# Altium schematic sheet Connectors.SchDoc
size A4; SheetNumber: 4; SheetTotal: 5
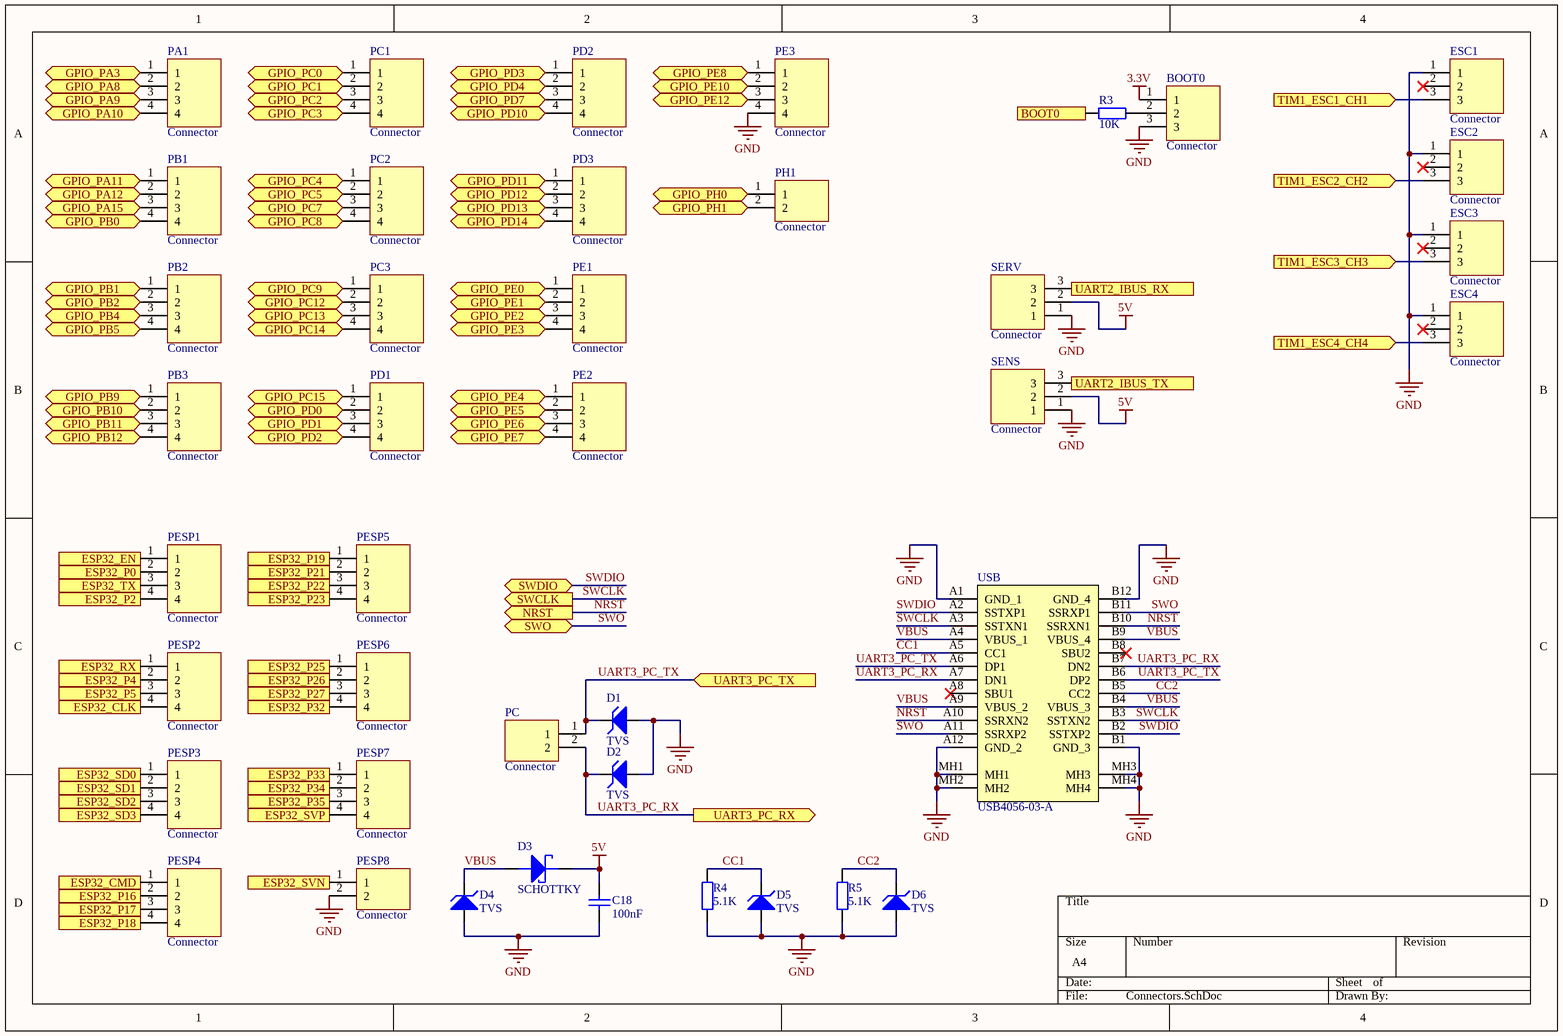
[diagram p0: Connectors.SchDoc]

## Parts
BOOT0  Connector  [FP_CONN3_TUSKE_254MM]
C18  100nF  [FP_0805_CAP_085]
D1  TVS  [FP_SMB]
D2  TVS  [FP_SMB]
D3  SCHOTTKY  [FP_SMA]
D4  TVS  [FP_SMB]
D5  TVS  [FP_SMB]
D6  TVS  [FP_SMB]
ESC1  Connector  [FP_CONN3_TUSKE_254MM]
ESC2  Connector  [FP_CONN3_TUSKE_254MM]
ESC3  Connector  [FP_CONN3_TUSKE_254MM]
ESC4  Connector  [FP_CONN3_TUSKE_254MM]
PA1  Connector  [FP_CONN4_TUSKE_254MM]
PB1  Connector  [FP_CONN4_TUSKE_254MM]
PB2  Connector  [FP_CONN4_TUSKE_254MM]
PB3  Connector  [FP_CONN4_TUSKE_254MM]
PC  Connector  [FP_CONN2_TUSKE_254MM]
PC1  Connector  [FP_CONN4_TUSKE_254MM]
PC2  Connector  [FP_CONN4_TUSKE_254MM]
PC3  Connector  [FP_CONN4_TUSKE_254MM]
PD1  Connector  [FP_CONN4_TUSKE_254MM]
PD2  Connector  [FP_CONN4_TUSKE_254MM]
PD3  Connector  [FP_CONN4_TUSKE_254MM]
PE1  Connector  [FP_CONN4_TUSKE_254MM]
PE2  Connector  [FP_CONN4_TUSKE_254MM]
PE3  Connector  [FP_CONN4_TUSKE_254MM]
PESP1  Connector  [FP_CONN4_TUSKE_254MM]
PESP2  Connector  [FP_CONN4_TUSKE_254MM]
PESP3  Connector  [FP_CONN4_TUSKE_254MM]
PESP4  Connector  [FP_CONN4_TUSKE_254MM]
PESP5  Connector  [FP_CONN4_TUSKE_254MM]
PESP6  Connector  [FP_CONN4_TUSKE_254MM]
PESP7  Connector  [FP_CONN4_TUSKE_254MM]
PESP8  Connector  [FP_CONN2_TUSKE_254MM]
PH1  Connector  [FP_CONN2_TUSKE_254MM]
R3  10K  [FP_0805_RES]
R4  5.1K  [FP_0805_RES]
R5  5.1K  [FP_0805_RES]
SENS  Connector  [FP_CONN3_TUSKE_254MM]
SERV  Connector  [FP_CONN3_TUSKE_254MM]
USB  USB4056-03-A  [USB4056-03-A_REVA2]

## Ports
BOOT0 (out), ESP32_CLK, ESP32_CMD, ESP32_EN, ESP32_P0, ESP32_P2, ESP32_P4, ESP32_P5, ESP32_P16, ESP32_P17, ESP32_P18, ESP32_P19, ESP32_P21, ESP32_P22, ESP32_P23, ESP32_P25, ESP32_P26, ESP32_P27, ESP32_P32, ESP32_P33, ESP32_P34, ESP32_P35, ESP32_RX, ESP32_SD0, ESP32_SD1, ESP32_SD2, ESP32_SD3, ESP32_SVN, ESP32_SVP, ESP32_TX, GPIO_PA3 (bidir), GPIO_PA8 (bidir), GPIO_PA9 (bidir), GPIO_PA10 (bidir), GPIO_PA11 (bidir), GPIO_PA12 (bidir), GPIO_PA15 (bidir), GPIO_PB0 (bidir), GPIO_PB1 (bidir), GPIO_PB2 (bidir), GPIO_PB4 (bidir), GPIO_PB5 (bidir), GPIO_PB9 (bidir), GPIO_PB10 (bidir), GPIO_PB11 (bidir), GPIO_PB12 (bidir), GPIO_PC0 (bidir), GPIO_PC1 (bidir), GPIO_PC2 (bidir), GPIO_PC3 (bidir), GPIO_PC4 (bidir), GPIO_PC5 (bidir), GPIO_PC7 (bidir), GPIO_PC8 (bidir), GPIO_PC9 (bidir), GPIO_PC12 (bidir), GPIO_PC13 (bidir), GPIO_PC14 (bidir), GPIO_PC15 (bidir), GPIO_PD0 (bidir), GPIO_PD1 (bidir), GPIO_PD2 (bidir), GPIO_PD3 (bidir), GPIO_PD4 (bidir), GPIO_PD7 (bidir), GPIO_PD10 (bidir), GPIO_PD11 (bidir), GPIO_PD12 (bidir), GPIO_PD13 (bidir), GPIO_PD14 (bidir), GPIO_PE0 (bidir), GPIO_PE1 (bidir), GPIO_PE2 (bidir), GPIO_PE3 (bidir), GPIO_PE4 (bidir), GPIO_PE5 (bidir), GPIO_PE6 (bidir), GPIO_PE7 (bidir), GPIO_PE8 (bidir), GPIO_PE10 (bidir), GPIO_PE12 (bidir), GPIO_PH0 (bidir), GPIO_PH1 (bidir), NRST (out), SWCLK (out), SWDIO (bidir), SWO (bidir), TIM1_ESC1_CH1 (in), TIM1_ESC2_CH2 (in), TIM1_ESC3_CH3 (in), TIM1_ESC4_CH4 (in), UART2_IBUS_RX (out), UART2_IBUS_TX (in), UART3_PC_RX (out), UART3_PC_TX (in)

## Nets
3.3V: BOOT0.1
5V: C18.2 D3.K(CATHODE) SENS.2 SERV.2
GND: BOOT0.3 C18.1 D1.A D2.A D4.A D5.A D6.A ESC1.1 ESC2.1 ESC3.1 ESC4.1 PE3.4 PESP8.2 R4.1 R5.1 SENS.1 SERV.1 USB.A1(GND_1) USB.A12(GND_2) USB.B1(GND_3) USB.B12(GND_4) USB.MH1 USB.MH2 USB.MH3 USB.MH4
BOOT0: R3.2 ; port BOOT0
CC1: D5.K R4.2 USB.A5(CC1)
CC2: D6.K R5.2 USB.B5(CC2)
ESP32_CLK: PESP2.4 ; port ESP32_CLK
ESP32_CMD: PESP4.1 ; port ESP32_CMD
ESP32_EN: PESP1.1 ; port ESP32_EN
ESP32_P0: PESP1.2 ; port ESP32_P0
ESP32_P2: PESP1.4 ; port ESP32_P2
ESP32_P4: PESP2.2 ; port ESP32_P4
ESP32_P5: PESP2.3 ; port ESP32_P5
ESP32_P16: PESP4.2 ; port ESP32_P16
ESP32_P17: PESP4.3 ; port ESP32_P17
ESP32_P18: PESP4.4 ; port ESP32_P18
ESP32_P19: PESP5.1 ; port ESP32_P19
ESP32_P21: PESP5.2 ; port ESP32_P21
ESP32_P22: PESP5.3 ; port ESP32_P22
ESP32_P23: PESP5.4 ; port ESP32_P23
ESP32_P25: PESP6.1 ; port ESP32_P25
ESP32_P26: PESP6.2 ; port ESP32_P26
ESP32_P27: PESP6.3 ; port ESP32_P27
ESP32_P32: PESP6.4 ; port ESP32_P32
ESP32_P33: PESP7.1 ; port ESP32_P33
ESP32_P34: PESP7.2 ; port ESP32_P34
ESP32_P35: PESP7.3 ; port ESP32_P35
ESP32_RX: PESP2.1 ; port ESP32_RX
ESP32_SD0: PESP3.1 ; port ESP32_SD0
ESP32_SD1: PESP3.2 ; port ESP32_SD1
ESP32_SD2: PESP3.3 ; port ESP32_SD2
ESP32_SD3: PESP3.4 ; port ESP32_SD3
ESP32_SVN: PESP8.1 ; port ESP32_SVN
ESP32_SVP: PESP7.4 ; port ESP32_SVP
ESP32_TX: PESP1.3 ; port ESP32_TX
GPIO_PA3: PA1.1 ; port GPIO_PA3
GPIO_PA8: PA1.2 ; port GPIO_PA8
GPIO_PA9: PA1.3 ; port GPIO_PA9
GPIO_PA10: PA1.4 ; port GPIO_PA10
GPIO_PA11: PB1.1 ; port GPIO_PA11
GPIO_PA12: PB1.2 ; port GPIO_PA12
GPIO_PA15: PB1.3 ; port GPIO_PA15
GPIO_PB0: PB1.4 ; port GPIO_PB0
GPIO_PB1: PB2.1 ; port GPIO_PB1
GPIO_PB2: PB2.2 ; port GPIO_PB2
GPIO_PB4: PB2.3 ; port GPIO_PB4
GPIO_PB5: PB2.4 ; port GPIO_PB5
GPIO_PB9: PB3.1 ; port GPIO_PB9
GPIO_PB10: PB3.2 ; port GPIO_PB10
GPIO_PB11: PB3.3 ; port GPIO_PB11
GPIO_PB12: PB3.4 ; port GPIO_PB12
GPIO_PC0: PC1.1 ; port GPIO_PC0
GPIO_PC1: PC1.2 ; port GPIO_PC1
GPIO_PC2: PC1.3 ; port GPIO_PC2
GPIO_PC3: PC1.4 ; port GPIO_PC3
GPIO_PC4: PC2.1 ; port GPIO_PC4
GPIO_PC5: PC2.2 ; port GPIO_PC5
GPIO_PC7: PC2.3 ; port GPIO_PC7
GPIO_PC8: PC2.4 ; port GPIO_PC8
GPIO_PC9: PC3.1 ; port GPIO_PC9
GPIO_PC12: PC3.2 ; port GPIO_PC12
GPIO_PC13: PC3.3 ; port GPIO_PC13
GPIO_PC14: PC3.4 ; port GPIO_PC14
GPIO_PC15: PD1.1 ; port GPIO_PC15
GPIO_PD0: PD1.2 ; port GPIO_PD0
GPIO_PD1: PD1.3 ; port GPIO_PD1
GPIO_PD2: PD1.4 ; port GPIO_PD2
GPIO_PD3: PD2.1 ; port GPIO_PD3
GPIO_PD4: PD2.2 ; port GPIO_PD4
GPIO_PD7: PD2.3 ; port GPIO_PD7
GPIO_PD10: PD2.4 ; port GPIO_PD10
GPIO_PD11: PD3.1 ; port GPIO_PD11
GPIO_PD12: PD3.2 ; port GPIO_PD12
GPIO_PD13: PD3.3 ; port GPIO_PD13
GPIO_PD14: PD3.4 ; port GPIO_PD14
GPIO_PE0: PE1.1 ; port GPIO_PE0
GPIO_PE1: PE1.2 ; port GPIO_PE1
GPIO_PE2: PE1.3 ; port GPIO_PE2
GPIO_PE3: PE1.4 ; port GPIO_PE3
GPIO_PE4: PE2.1 ; port GPIO_PE4
GPIO_PE5: PE2.2 ; port GPIO_PE5
GPIO_PE6: PE2.3 ; port GPIO_PE6
GPIO_PE7: PE2.4 ; port GPIO_PE7
GPIO_PE8: PE3.1 ; port GPIO_PE8
GPIO_PE10: PE3.2 ; port GPIO_PE10
GPIO_PE12: PE3.3 ; port GPIO_PE12
GPIO_PH0: PH1.1 ; port GPIO_PH0
GPIO_PH1: PH1.2 ; port GPIO_PH1
NRST: USB.A10(SSRXN2) USB.B10(SSRXN1) ; port NRST
SWCLK: USB.A3(SSTXN1) USB.B3(SSTXN2) ; port SWCLK
SWDIO: USB.A2(SSTXP1) USB.B2(SSTXP2) ; port SWDIO
SWO: USB.A11(SSRXP2) USB.B11(SSRXP1) ; port SWO
TIM1_ESC1_CH1: ESC1.3 ; port TIM1_ESC1_CH1
TIM1_ESC2_CH2: ESC2.3 ; port TIM1_ESC2_CH2
TIM1_ESC3_CH3: ESC3.3 ; port TIM1_ESC3_CH3
TIM1_ESC4_CH4: ESC4.3 ; port TIM1_ESC4_CH4
UART2_IBUS_RX: SERV.3 ; port UART2_IBUS_RX
UART2_IBUS_TX: SENS.3 ; port UART2_IBUS_TX
UART3_PC_RX: D2.K PC.2 USB.A7(DN1) USB.B7(DN2) ; port UART3_PC_RX
UART3_PC_TX: D1.K PC.1 USB.A6(DP1) USB.B6(DP2) ; port UART3_PC_TX
VBUS: D3.A(ANODE) D4.K USB.A4(VBUS_1) USB.A9(VBUS_2) USB.B4(VBUS_3) USB.B9(VBUS_4)
NetBOOT0_2: BOOT0.2 R3.1

Not connected (* = marked no-connect by the designer): ESC1 2*; ESC2 2*; ESC3 2*; ESC4 2*; USB A8(SBU1)* B8(SBU2)*

## Library data of the parts
BOOT0 ESC1-ESC4 SENS SERV = Connector_3pin: 3pin connector
C18 = CAP: Capacitor; Value: 100nF
D1 D2 D4-D6 = ZENER: Zener Diode
D3 = SCHOTTKY: Schottky diode
PA1 PB1-PB3 PC1-PC3 PD1-PD3 PE1-PE3 PESP1-PESP7 = Connector_4pin: 4pin Connector
PC PESP8 PH1 = Connector_2pin: 2pin connector
R3-R5 = RES: Resistor
  R3: Value: 10K
  R4 R5: Value: 5.1K
USB = USB4056-03-A: USB Connectors USB C 3.2 Rec, Horz, Hybrid PCB Top Mount, T+R; Manufacturer_Name: GCT (GLOBAL CONNECTOR TECHNOLOGY); Geometry.Height: 3.56mm; Mouser Part Number: 640-USB4056-03-A; Mouser Price/Stock: https://www.mouser.co.uk/ProductDetail/GCT/USB4056-03-A?qs=QNEnbhJQKvbZ7hZzgFEugA%3D%3D; Manufacturer_Part_Number: USB4056-03-A; Datasheet Link: https://www.mouser.jp/datasheet/2/837/usb4056-2448808.pdf